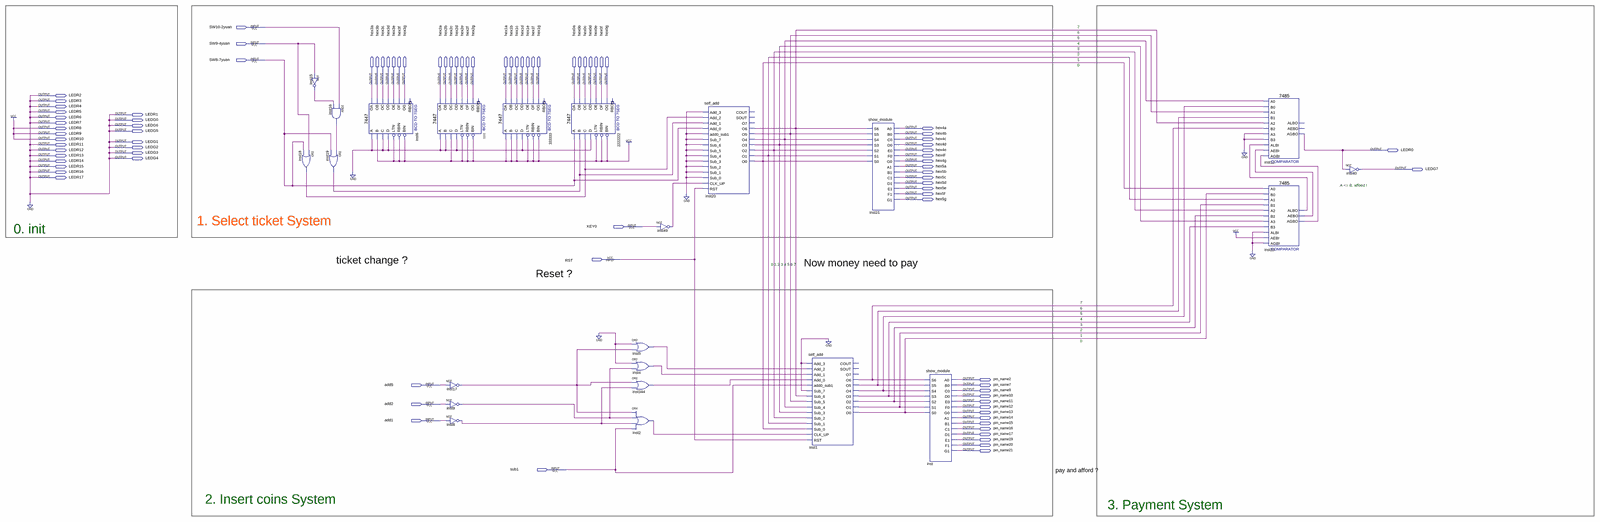
[diagram p0: schematic sheet, whole]
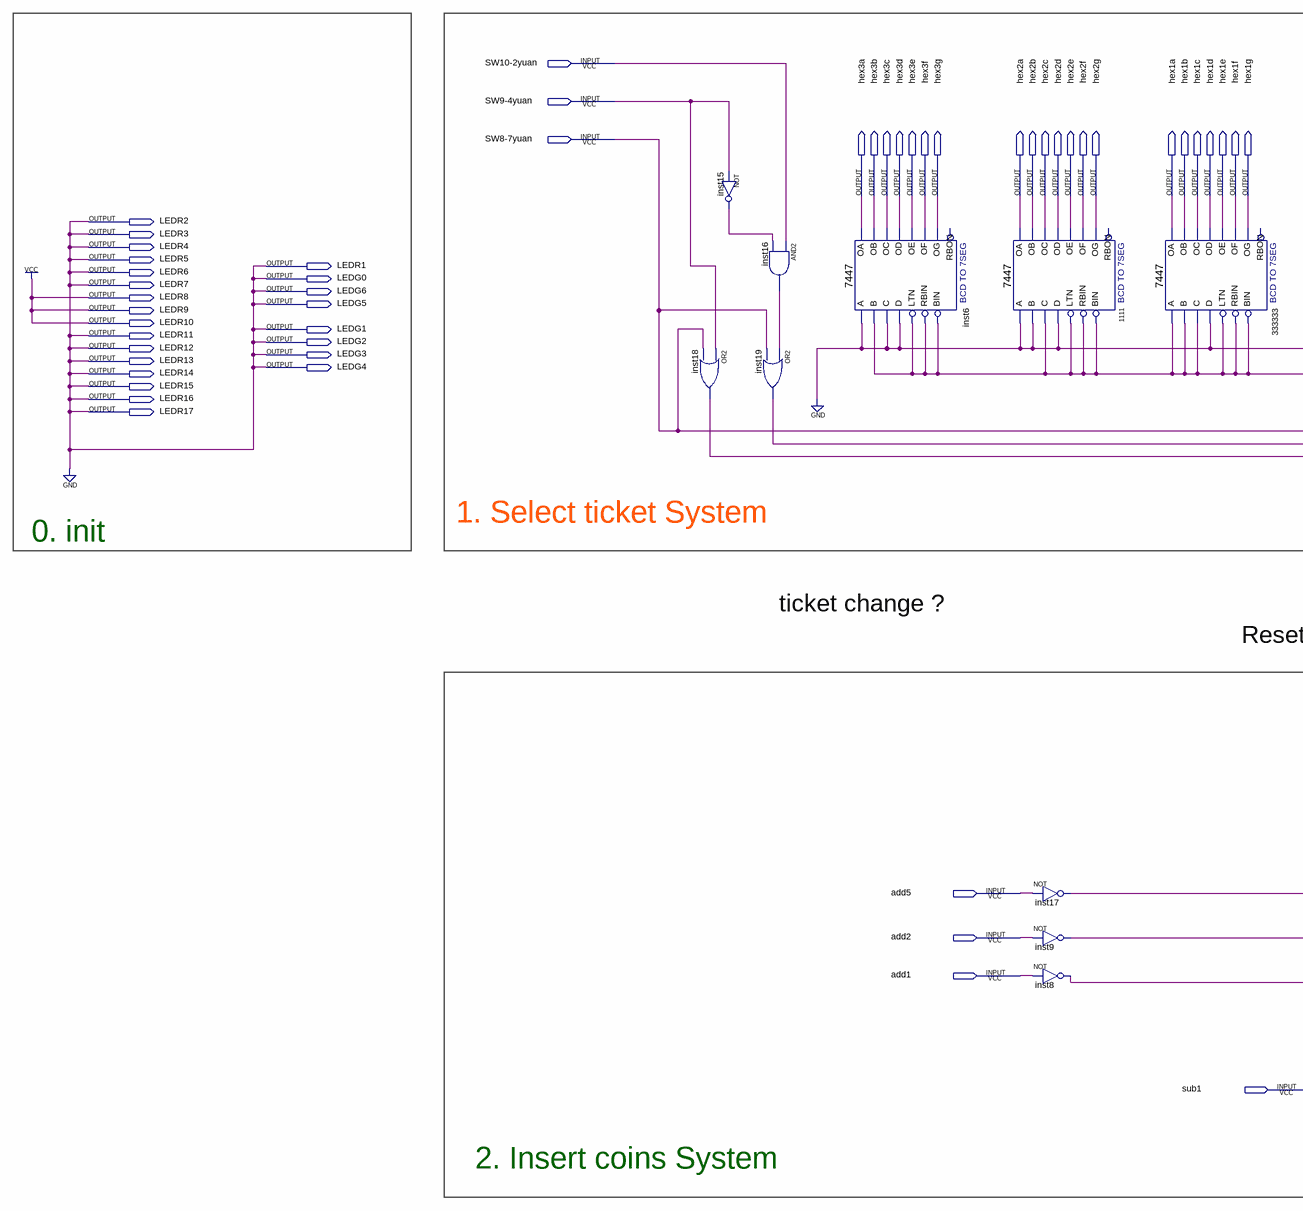
[diagram p1: schematic sheet, left part]
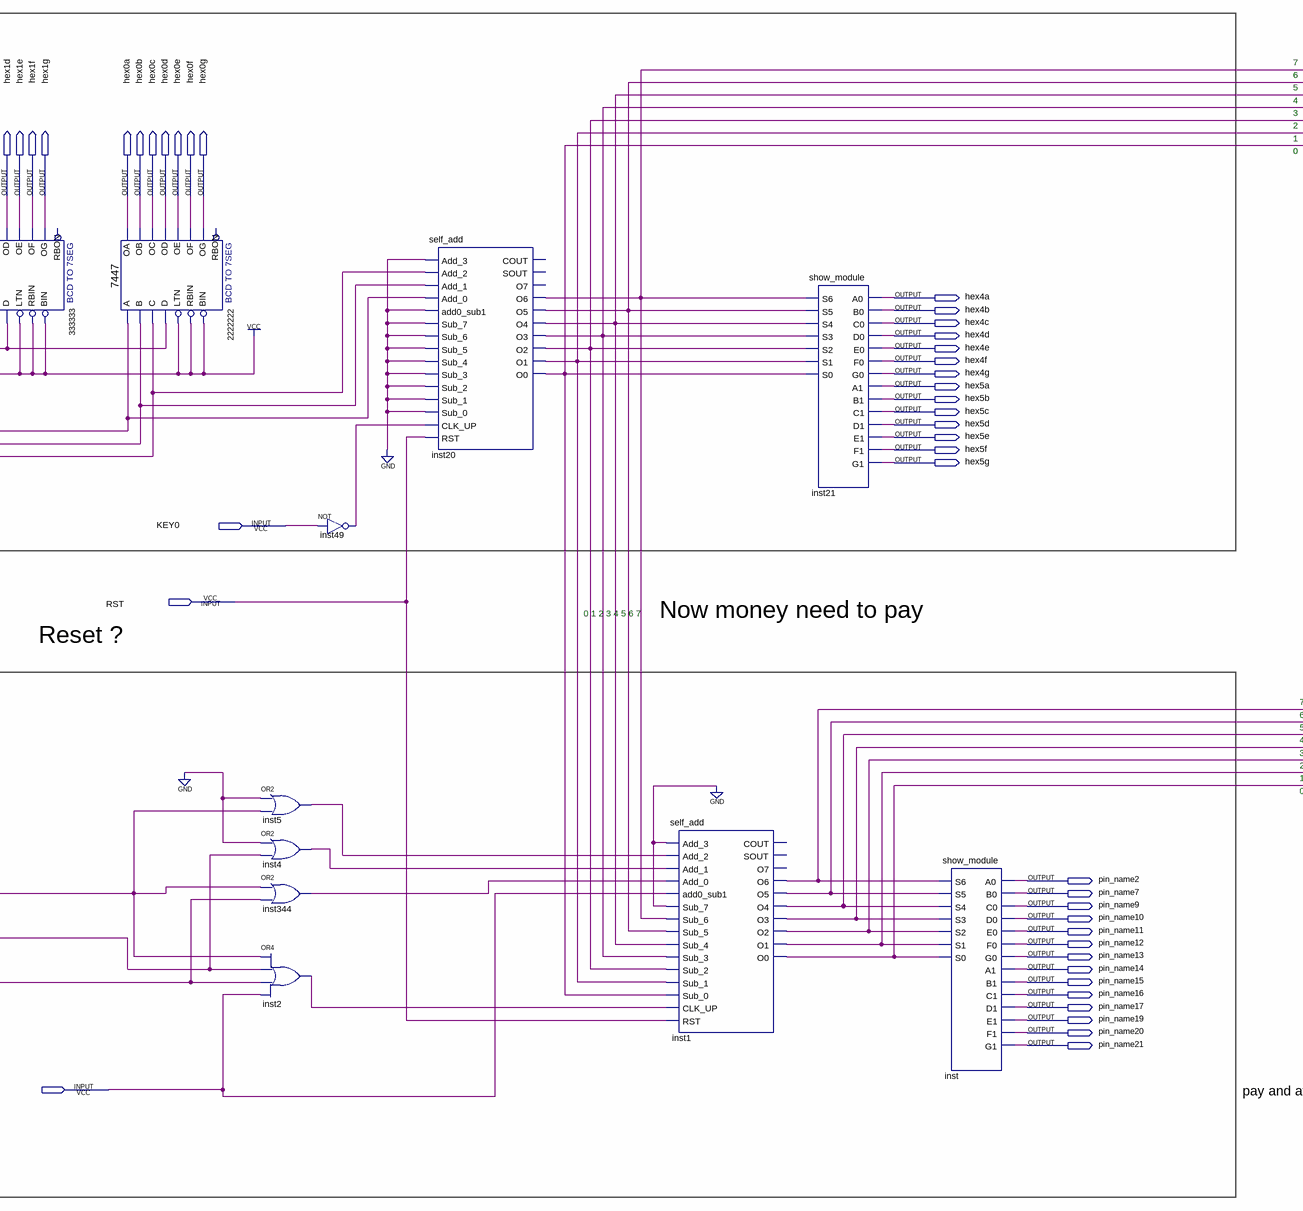
[diagram p2: schematic sheet, centre part]
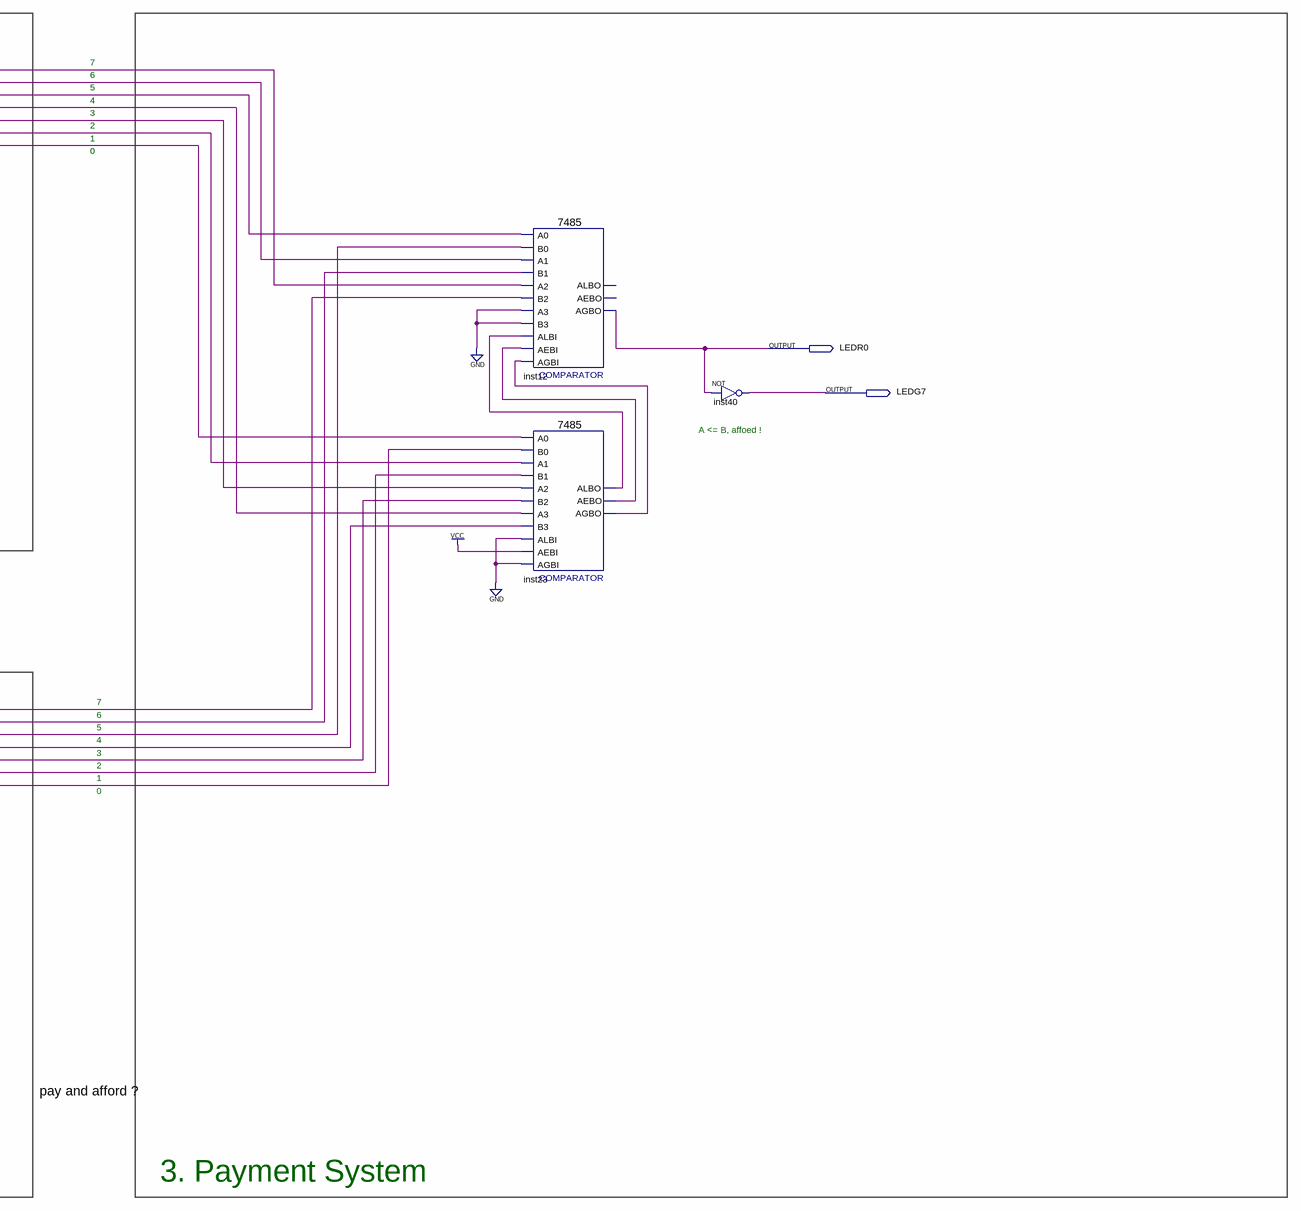
[diagram p3: schematic sheet, right part]
// Quartus schematic SHIYAN3.bdf as structural Verilog: 23 symbols, 91 pins
module SHIYAN3 (
  input  \SW10-2yuan ,
  input  \SW9-4yuan ,
  input  \SW8-7yuan ,
  input  KEY0,
  input  RST,
  input  add5,
  input  add2,
  input  add1,
  input  sub1,
  output hex3a,
  output hex3b,
  output hex3c,
  output hex3d,
  output hex3e,
  output hex3f,
  output hex3g,
  output hex2a,
  output hex2b,
  output hex2c,
  output hex2d,
  output hex2e,
  output hex2f,
  output hex2g,
  output hex1a,
  output hex1b,
  output hex1c,
  output hex1d,
  output hex1e,
  output hex1f,
  output hex1g,
  output hex0a,
  output hex0b,
  output hex0c,
  output hex0d,
  output hex0e,
  output hex0f,
  output hex0g,
  output LEDR2,
  output LEDR3,
  output LEDR4,
  output LEDR5,
  output LEDR1,
  output LEDR6,
  output LEDG0,
  output LEDR7,
  output LEDG6,
  output LEDR8,
  output hex4a,
  output LEDG5,
  output LEDR9,
  output hex4b,
  output LEDR10,
  output hex4c,
  output LEDG1,
  output LEDR11,
  output hex4d,
  output LEDG2,
  output LEDR12,
  output hex4e,
  output LEDR0,
  output LEDG3,
  output LEDR13,
  output hex4f,
  output LEDG4,
  output LEDR14,
  output hex4g,
  output LEDR15,
  output hex5a,
  output LEDG7,
  output LEDR16,
  output hex5b,
  output LEDR17,
  output hex5c,
  output hex5d,
  output hex5e,
  output hex5f,
  output hex5g,
  output pin_name2,
  output pin_name7,
  output pin_name9,
  output pin_name10,
  output pin_name11,
  output pin_name12,
  output pin_name13,
  output pin_name14,
  output pin_name15,
  output pin_name16,
  output pin_name17,
  output pin_name19,
  output pin_name20,
  output pin_name21
);

  wire inst1_o0, inst1_o1, inst1_o2, inst1_o3, inst1_o4, inst1_o5, inst1_o6, inst2_out, inst4_out, inst5_out,
       inst8_out, inst9_out, inst15_out, inst16_out, inst17_out, inst18_out, inst19_out, inst20_o0,
       inst20_o1, inst20_o2, inst20_o3, inst20_o4, inst20_o5, inst20_o6, inst23_aebo, inst23_agbo,
       inst23_albo, inst49_out, inst344_out;

  not inst15 (inst15_out, \SW9-4yuan );
  or inst18 (inst18_out, \SW9-4yuan , \SW8-7yuan );
  and inst16 (inst16_out, \SW10-2yuan , inst15_out);
  or inst19 (inst19_out, inst16_out, \SW8-7yuan );
  \7447  inst6 (
    .LTN(1'b1), .B(1'b1), .C(1'b0), .D(1'b0), .RBIN(1'b1), .BIN(1'b1), .A(1'b0), .OB(hex3b), .OC(hex3c),
    .OE(hex3e), .OD(hex3d), .OF(hex3f), .OG(hex3g), .OA(hex3a));  // open: RBON
  \7447  u_1111 (
    .LTN(1'b1), .B(1'b0), .C(1'b1), .D(1'b0), .RBIN(1'b1), .BIN(1'b1), .A(1'b0), .OB(hex2b), .OC(hex2c),
    .OE(hex2e), .OD(hex2d), .OF(hex2f), .OG(hex2g), .OA(hex2a));  // open: RBON
  not inst17 (inst17_out, add5);
  not inst9 (inst9_out, add2);
  not inst8 (inst8_out, add1);
  \7447  u_333333 (
    .LTN(1'b1), .B(1'b1), .C(1'b1), .D(1'b0), .RBIN(1'b1), .BIN(1'b1), .A(1'b1), .OB(hex1b), .OC(hex1c),
    .OE(hex1e), .OD(hex1d), .OF(hex1f), .OG(hex1g), .OA(hex1a));  // open: RBON
  \7447  u_2222222 (
    .LTN(1'b1), .B(inst19_out), .C(inst18_out), .D(1'b0), .RBIN(1'b1), .BIN(1'b1), .A(\SW8-7yuan ),
    .OB(hex0b), .OC(hex0c), .OE(hex0e), .OD(hex0d), .OF(hex0f), .OG(hex0g), .OA(hex0a));  // open: RBON
  or inst5 (inst5_out, 1'b0, inst17_out);
  or inst4 (inst4_out, 1'b0, inst9_out);
  or inst344 (inst344_out, inst17_out, inst8_out);
  or inst2 (inst2_out, inst17_out, inst9_out, inst8_out, sub1);
  not inst49 (inst49_out, KEY0);
  self_add inst20 (
    .Add_3(1'b0), .Add_2(inst18_out), .Add_1(inst19_out), .Add_0(\SW8-7yuan ), .add0_sub1(1'b0),
    .Sub_7(1'b0), .Sub_6(1'b0), .Sub_5(1'b0), .Sub_4(1'b0), .Sub_3(1'b0), .Sub_2(1'b0), .Sub_1(1'b0),
    .Sub_0(1'b0), .CLK_UP(inst49_out), .RST(RST), .O6(inst20_o6), .O5(inst20_o5), .O4(inst20_o4),
    .O3(inst20_o3), .O2(inst20_o2), .O1(inst20_o1), .O0(inst20_o0));  // open: COUT, SOUT, O7
  self_add inst1 (
    .Add_3(1'b0), .Add_2(inst5_out), .Add_1(inst4_out), .Add_0(inst344_out), .add0_sub1(sub1), .Sub_7(1'b0),
    .Sub_6(inst20_o6), .Sub_5(inst20_o5), .Sub_4(inst20_o4), .Sub_3(inst20_o3), .Sub_2(inst20_o2),
    .Sub_1(inst20_o1), .Sub_0(inst20_o0), .CLK_UP(inst2_out), .RST(RST), .O6(inst1_o6), .O5(inst1_o5),
    .O4(inst1_o4), .O3(inst1_o3), .O2(inst1_o2), .O1(inst1_o1), .O0(inst1_o0));  // open: COUT, SOUT, O7
  show_module inst21 (
    .S6(inst20_o6), .S5(inst20_o5), .S4(inst20_o4), .S3(inst20_o3), .S2(inst20_o2), .S1(inst20_o1),
    .S0(inst20_o0), .A0(hex4a), .B0(hex4b), .C0(hex4c), .D0(hex4d), .E0(hex4e), .F0(hex4f), .G0(hex4g),
    .A1(hex5a), .B1(hex5b), .C1(hex5c), .D1(hex5d), .E1(hex5e), .F1(hex5f), .G1(hex5g));
  show_module inst (
    .S6(inst1_o6), .S5(inst1_o5), .S4(inst1_o4), .S3(inst1_o3), .S2(inst1_o2), .S1(inst1_o1), .S0(inst1_o0),
    .A0(pin_name2), .B0(pin_name7), .C0(pin_name9), .D0(pin_name10), .E0(pin_name11), .F0(pin_name12),
    .G0(pin_name13), .A1(pin_name14), .B1(pin_name15), .C1(pin_name16), .D1(pin_name17), .E1(pin_name19),
    .F1(pin_name20), .G1(pin_name21));
  \7485  inst12 (
    .A3(1'b0), .B2(inst1_o6), .A2(inst20_o6), .AEBI(inst23_aebo), .AGBI(inst23_agbo), .ALBI(inst23_albo),
    .A0(inst20_o4), .B0(inst1_o4), .B3(1'b0), .A1(inst20_o5), .B1(inst1_o5), .AGBO(LEDR0));  // open: ALBO, AEBO
  \7485  inst23 (
    .A3(inst20_o3), .B2(inst1_o2), .A2(inst20_o2), .AEBI(1'b1), .AGBI(1'b0), .ALBI(1'b0), .A0(inst20_o0),
    .B0(inst1_o0), .B3(inst1_o3), .A1(inst20_o1), .B1(inst1_o1), .ALBO(inst23_albo), .AGBO(inst23_agbo),
    .AEBO(inst23_aebo));
  not inst40 (LEDG7, LEDR0);

  assign LEDG0 = 1'b0;
  assign LEDG1 = 1'b0;
  assign LEDG2 = 1'b0;
  assign LEDG3 = 1'b0;
  assign LEDG4 = 1'b0;
  assign LEDG5 = 1'b0;
  assign LEDG6 = 1'b0;
  assign LEDR1 = 1'b0;
  assign LEDR2 = 1'b0;
  assign LEDR3 = 1'b0;
  assign LEDR4 = 1'b0;
  assign LEDR5 = 1'b0;
  assign LEDR6 = 1'b0;
  assign LEDR7 = 1'b0;
  assign LEDR8 = 1'b1;
  assign LEDR9 = 1'b1;
  assign LEDR10 = 1'b1;
  assign LEDR11 = 1'b0;
  assign LEDR12 = 1'b0;
  assign LEDR13 = 1'b0;
  assign LEDR14 = 1'b0;
  assign LEDR15 = 1'b0;
  assign LEDR16 = 1'b0;
  assign LEDR17 = 1'b0;

  // Notes on the sheet:
  //   7
  //   6
  //   5
  //   4
  //   3
  //   2
  //   1
  //   0
  //   A <= B, affoed !
  //   1. Select ticket System
  //   0. init
  //   ticket change ?
  //   Now money need to pay
  //   0 1 2 3 4 5 6 7
  //   Reset ?
  //   7
  //   6
  //   5
  //   4
  //   3
  //   2
  //   1
  //   0
  //   pay and afford ?
  //   2. Insert coins System
  //   3. Payment System
endmodule
